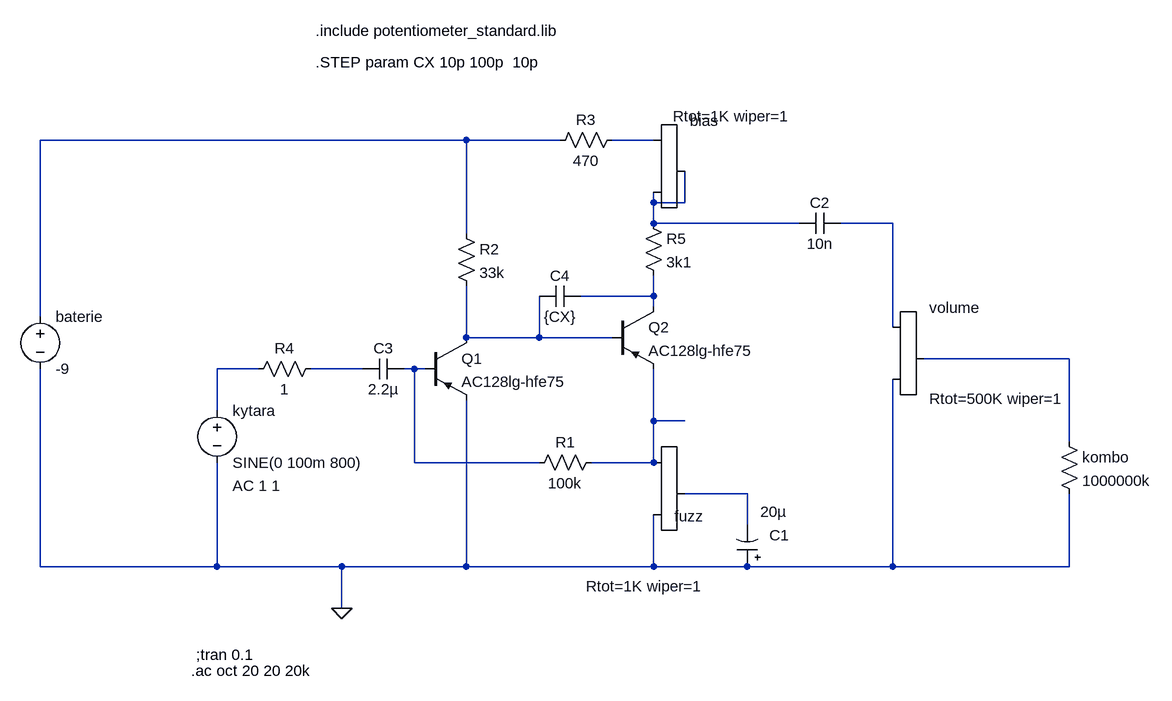
[diagram p0: schematic fuzz_pot.asc]
fuzz_pot.asc, the LTspice schematic file:
Version 4
SHEET 1 880 680
WIRE -224 -288 -880 -288
WIRE -80 -288 -224 -288
WIRE 64 -288 0 -288
WIRE 64 -192 64 -208
WIRE 112 -192 112 -240
WIRE 112 -192 64 -192
WIRE 64 -160 64 -192
WIRE 288 -160 64 -160
WIRE 432 -160 352 -160
WIRE -224 -144 -224 -288
WIRE 64 -48 64 -80
WIRE 64 -48 -48 -48
WIRE 64 -32 64 -48
WIRE -880 -16 -880 -288
WIRE 432 0 432 -160
WIRE -224 16 -224 -64
WIRE -112 16 -112 -48
WIRE -112 16 -224 16
WIRE 0 16 -112 16
WIRE 704 48 480 48
WIRE -544 64 -608 64
WIRE -384 64 -464 64
WIRE -304 64 -320 64
WIRE -288 64 -304 64
WIRE -608 128 -608 64
WIRE 64 144 64 64
WIRE 112 144 64 144
WIRE 704 176 704 48
WIRE -304 208 -304 64
WIRE -112 208 -304 208
WIRE 64 208 64 144
WIRE 64 208 -32 208
WIRE 208 256 112 256
WIRE 208 304 208 256
WIRE -880 368 -880 64
WIRE -608 368 -608 208
WIRE -608 368 -880 368
WIRE -416 368 -608 368
WIRE -224 368 -224 112
WIRE -224 368 -416 368
WIRE 64 368 64 288
WIRE 64 368 -224 368
WIRE 208 368 64 368
WIRE 432 368 432 80
WIRE 432 368 208 368
WIRE 704 368 704 256
WIRE 704 368 432 368
WIRE -416 432 -416 368
FLAG -416 432 0
SYMBOL pnp -288 16 R0
SYMATTR InstName Q1
SYMATTR Value AC128lg-hfe75
SYMBOL res -240 -160 R0
SYMATTR InstName R2
SYMATTR Value 33k
SYMBOL voltage -880 -32 R0
WINDOW 123 0 0 Left 0
WINDOW 39 0 0 Left 0
SYMATTR InstName baterie
SYMATTR Value -9
SYMBOL res 16 -304 R90
WINDOW 0 0 56 VBottom 0
WINDOW 3 32 56 VTop 0
SYMATTR InstName R3
SYMATTR Value 470
SYMBOL res 48 -176 R0
SYMATTR InstName R5
SYMATTR Value 3k1
SYMBOL pnp 0 -32 R0
SYMATTR InstName Q2
SYMATTR Value AC128lg-hfe75
SYMBOL cap 352 -176 R90
WINDOW 0 0 32 VBottom 0
WINDOW 3 32 32 VTop 0
SYMATTR InstName C2
SYMATTR Value 10n
SYMBOL res 688 160 R0
SYMATTR InstName kombo
SYMATTR Value 1000000k
SYMBOL cap -320 48 R90
WINDOW 0 0 32 VBottom 0
WINDOW 3 63 32 VBottom 0
SYMATTR InstName C3
SYMATTR Value 2.2µ
SYMBOL res -16 192 R90
WINDOW 0 0 56 VBottom 0
WINDOW 3 32 56 VTop 0
SYMATTR InstName R1
SYMATTR Value 100k
SYMBOL potentiometer_standard 416 -16 R0
SYMATTR InstName volume
SYMATTR Value Rtot=500K wiper=1
SYMATTR SpiceLine ""
SYMBOL voltage -608 112 R0
WINDOW 123 24 132 Left 0
WINDOW 39 0 0 Left 0
SYMATTR Value2 AC 1 1
SYMATTR InstName kytara
SYMATTR Value SINE(0 100m 800)
SYMBOL potentiometer_standard 48 -304 R0
WINDOW 3 46 -21 Left 0
WINDOW 38 48 -55 Left 0
SYMATTR Value Rtot=1K wiper=1
SYMATTR InstName bias
SYMATTR SpiceLine ""
SYMBOL polcap 224 368 R180
WINDOW 0 -49 48 Left 0
WINDOW 3 -45 84 Left 0
SYMATTR InstName C1
SYMATTR Value 20µ
SYMBOL potentiometer_standard 48 192 R0
WINDOW 0 48 99 Left 0
WINDOW 3 -88 206 Left 0
WINDOW 38 -87 243 Left 0
SYMATTR InstName fuzz
SYMATTR Value Rtot=1K wiper=1
SYMATTR SpiceLine ""
SYMBOL res -448 48 R90
WINDOW 0 0 56 VBottom 0
WINDOW 3 32 56 VTop 0
SYMATTR InstName R4
SYMATTR Value 1
SYMBOL cap -48 -64 R90
WINDOW 0 0 32 VBottom 0
WINDOW 3 32 32 VTop 0
SYMATTR InstName C4
SYMATTR Value {CX}
TEXT -640 504 Left 0 !;tran 0.1
TEXT -648 528 Left 0 !.ac oct 20 20 20k
TEXT -456 -456 Left 0 !.include potentiometer_standard.lib
TEXT -456 -408 Left 0 !.STEP param CX 10p 100p  10p

The netlist it stands for:
* fuzz_pot.asc
Q1 N006 N010 0 0 AC128lg-hfe75
R2 N001 N006 33k
V§baterie N001 0 -9
R3 N002 N001 470
R5 N003 N005 3k1
Q2 N005 N006 N011 0 AC128lg-hfe75
C2 N004 N003 10n
R§kombo N007 0 1000000k
C3 N010 N009 2.2µ
R1 N011 N010 100k
Xvolume N004 0 N007 Rtot=500K wiper=1
V§kytara N008 0 SINE(0 100m 800) AC 1 1
Xbias N002 N003 N003 Rtot=1K wiper=1
C1 0 N012 20µ
Xfuzz N011 0 N012 Rtot=1K wiper=1
R4 N009 N008 1
C4 N005 N006 {CX}
.model NPN NPN
.model PNP PNP
.lib standard.bjt
;tran 0.1
.ac oct 20 20 20k
.include potentiometer_standard.lib
.STEP param CX 10p 100p  10p
.backanno
.end